# EAGLE design 5vacnew (EAGLE 9.6.2)
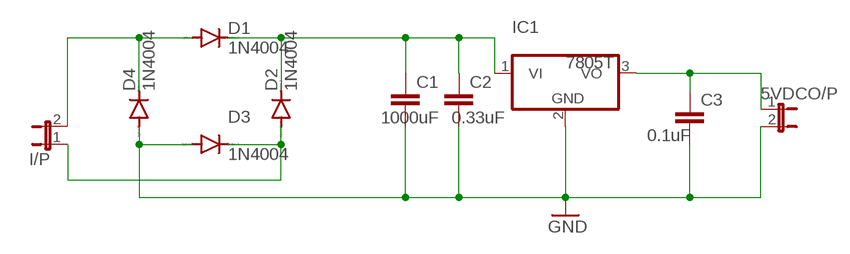
[diagram p0: schematic, sheet 1]

## Parts
5VDCO/P  JP1E  [JP1]
C1  1000uF  C2,5-3  [C2.5-3]
C2  0.33uF  C2,5-3  [C2.5-3]
C3  0.1uF  C2,5-3  [C2.5-3]
D1  1N4004  [DO41-10]
D2  1N4004  [DO41-10]
D3  1N4004  [DO41-10]
D4  1N4004  [DO41-10]
I/P  JP1E  [JP1]
IC1  7805T  [TO220H]

## Nets
GND: 5VDCO/P.2 C1.2 C2.2 C3.2 D3.A D4.A IC1.2(GND)
N$1: D1.A D4.C I/P.2
N$2: C1.1 C2.1 D1.C D2.C IC1.1(VI)
N$4: D2.A D3.C I/P.1
N$5: 5VDCO/P.1 C3.1 IC1.3(VO)

## Library data of the parts
5VDCO/P I/P = jumper:JP1E: JUMPER
C1-C3 = capacitor-wima:C: CAPACITOR naming: grid - package width
D1-D4 = diode:1N4004: DIODE general purpose rectifier, 1 A
IC1 = linear:78*: Positive VOLTAGE REGULATOR Source: http://cache.national.com/ds/LM/LM78L05.pdf http://www.fairchildsemi.com/ds/LM/LM7805.pdf

## Board
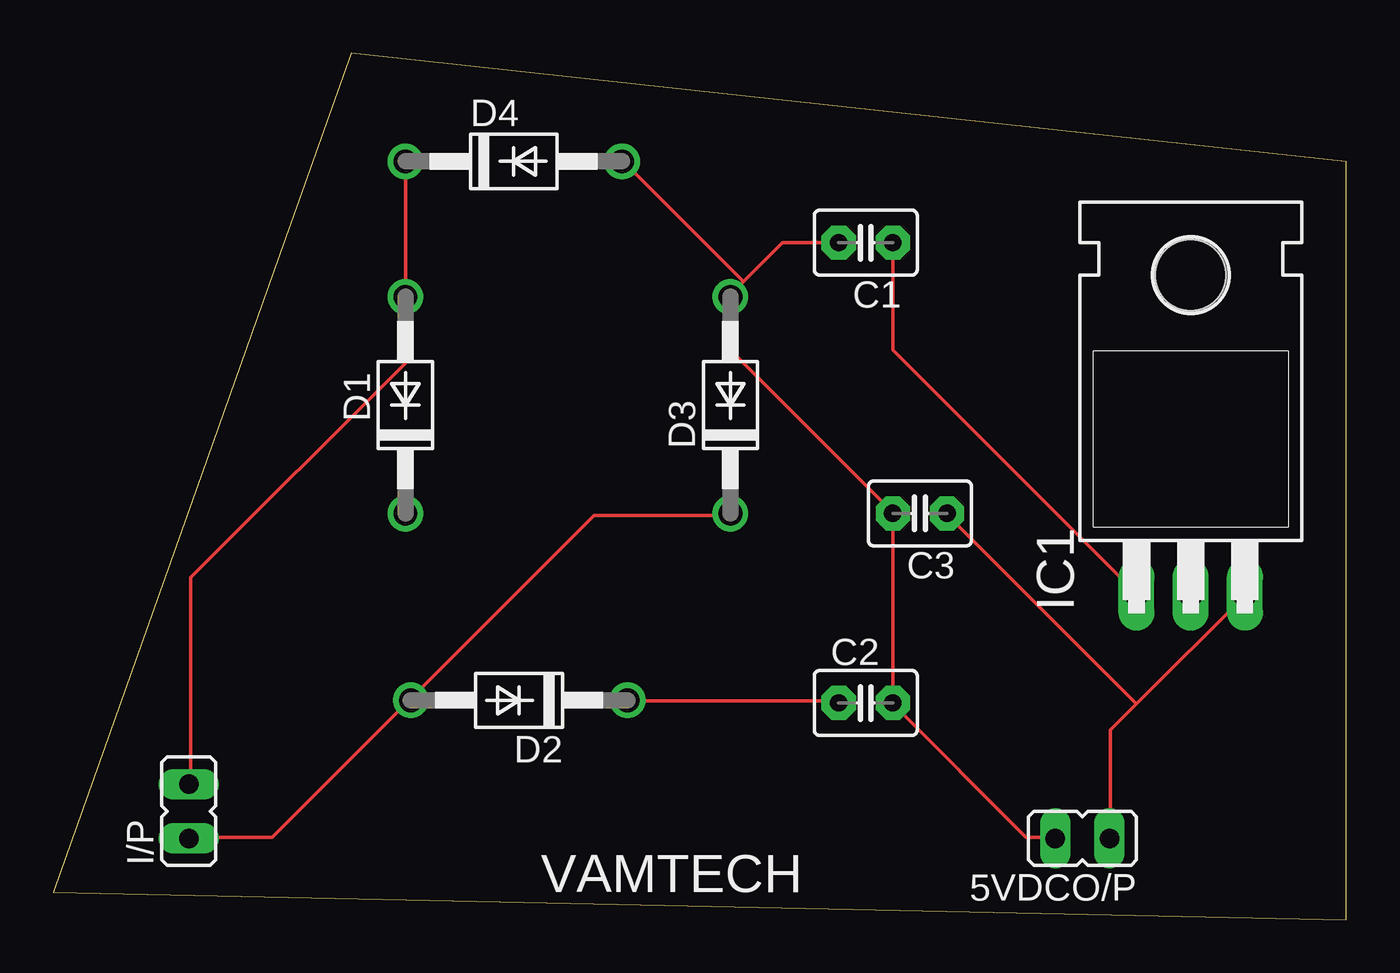
[diagram p1: board, top side]
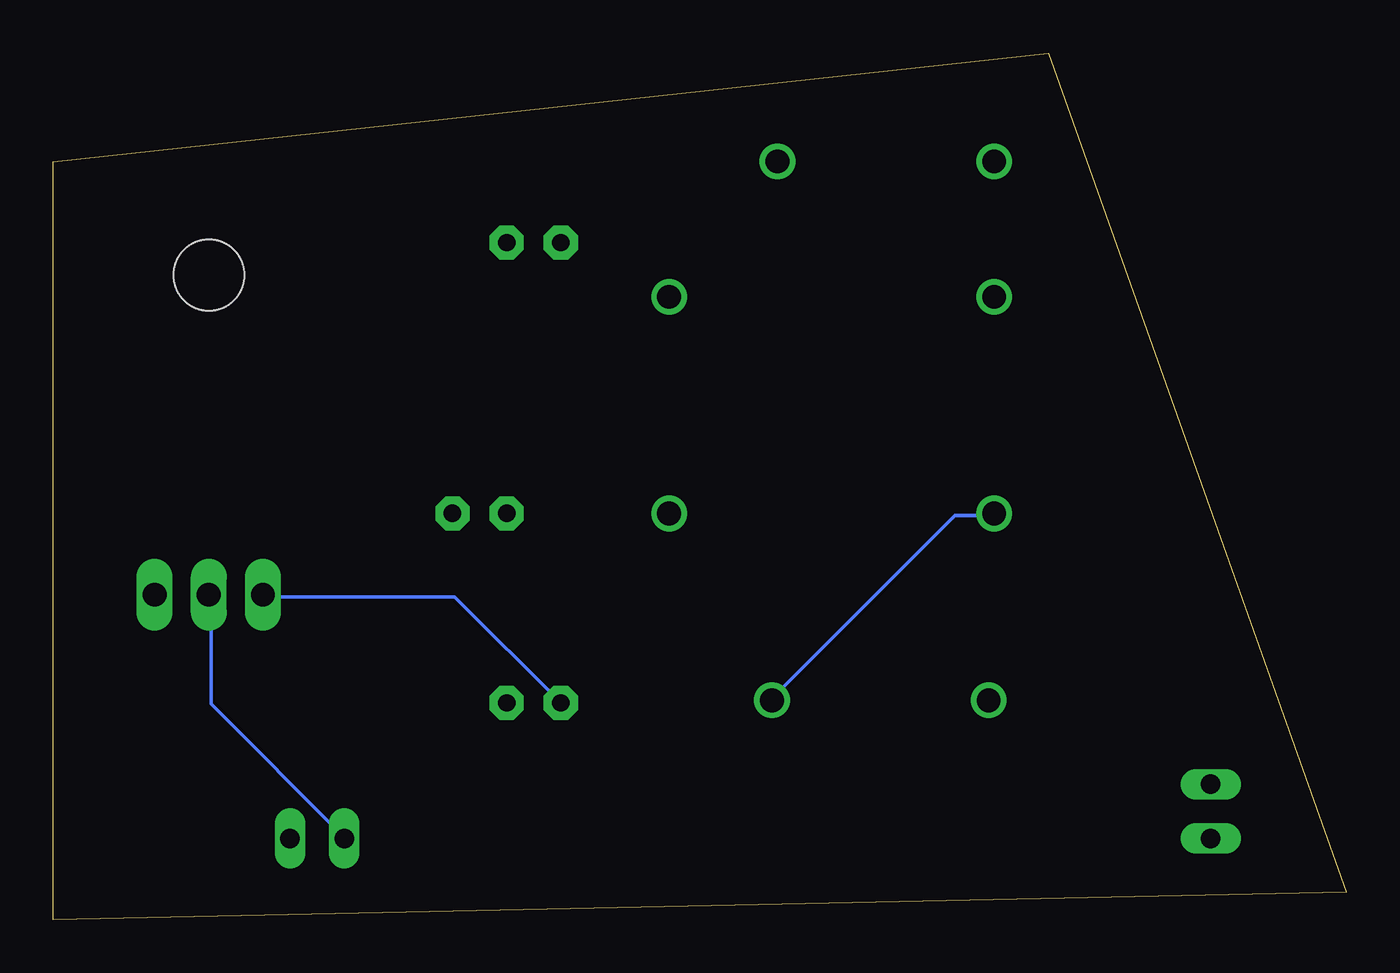
[diagram p2: board, bottom side, seen from below]

Size 60.63 x 40.63 mm. Coordinates in mm from the lower left corner, seen from the top.
Outline: 0,1.27 60.63,0 60.63,35.55 13.97,40.63 0,1.27
Copper layers (1*16): Top 0.035mm / dielectric 1.5mm / Bottom 0.035mm
Design rules "default": minimum track width 6mil, minimum drill 0.35mm, track to track 6mil, track to pad 6mil, pad to pad 6mil, via to via 6mil, smd to smd 6mil, copper to edge 40mil, drill to drill 6mil, minimum pad ring 10mil, minimum via ring 8mil, stop-mask expansion 4mil, vias tented up to drill 0mil, thermal gap 10mil

### Footprints (pad centres in the part's own frame; a part is rotated, then mirrored left to right if it is on the bottom)
JP1 = drill 0.914 long: 1 0,-1.27; 2 0,1.27
C2.5-3 = drill 0.813 pad 1.6 octagon: 1 -1.27,0; 2 1.27,0
DO41-10 = drill 1.118: A 5.08,0; C -5.08,0
TO220H = drill 1.118 long: 1 -2.54,-10.16; 2 0,-10.16; 3 2.54,-10.16 | hole 3.302: 0,4.826

### Placement (x,y rotation side)
5VDCO/P  48.26,3.81 90 top
C1  38.1,31.75 180 top
C2  38.1,10.16 0 top
C3  40.64,19.05 180 top
D1  16.51,24.13 90 top
D2  21.84,10.29 180 top
D3  31.75,24.13 90 top
D4  21.59,35.56 0 top
I/P  6.35,5.08 0 top
IC1  53.34,25.4 0 top

### Tracks (layer width: path | path; a pad name or v marks a point on that pad's centre or on a via)
GND
  Top 0.152: C1.2 34.19,31.75 32.36,29.92 | 32.36,29.92 31.75,29.31 D3.A 31.75,26.72 39.37,19.1 C3.2 C2.2 39.37,10.11 45.62,3.86 46.99,3.86 5VDCO/P.2 | 32.36,29.92 26.72,35.56 D4.A
  Bottom 0.152: IC1.2 53.24,15.14 53.24,10.11 46.99,3.86 5VDCO/P.2
N$1
  Top 0.152: I/P.2 6.45,6.45 6.45,16.05 16.51,26.11 D1.A D4.C
N$2
  Top 0.152: C1.1 39.37,26.72 50.8,15.29 IC1.1 | C2.1 36.78,10.26 27.03,10.26 D2.C
  Bottom 0.152: D1.C 16.51,18.95 18.34,18.95 26.87,10.41 D2.C | C2.1 41.81,15.14 50.8,15.14 IC1.1
N$4
  Top 0.152: I/P.1 6.45,3.86 10.26,3.86 16.66,10.26 D2.A 16.82,10.41 25.35,18.95 31.75,18.95 D3.C
N$5
  Top 0.152: 50.8,10.11 55.83,15.14 IC1.3 | 50.8,10.11 49.58,8.89 49.58,3.86 5VDCO/P.1 | 50.8,10.11 41.96,18.95 C3.1

### Text on the board
tPlace: VAMTECH